# Altium schematic sheet Main.SchDoc
size A4
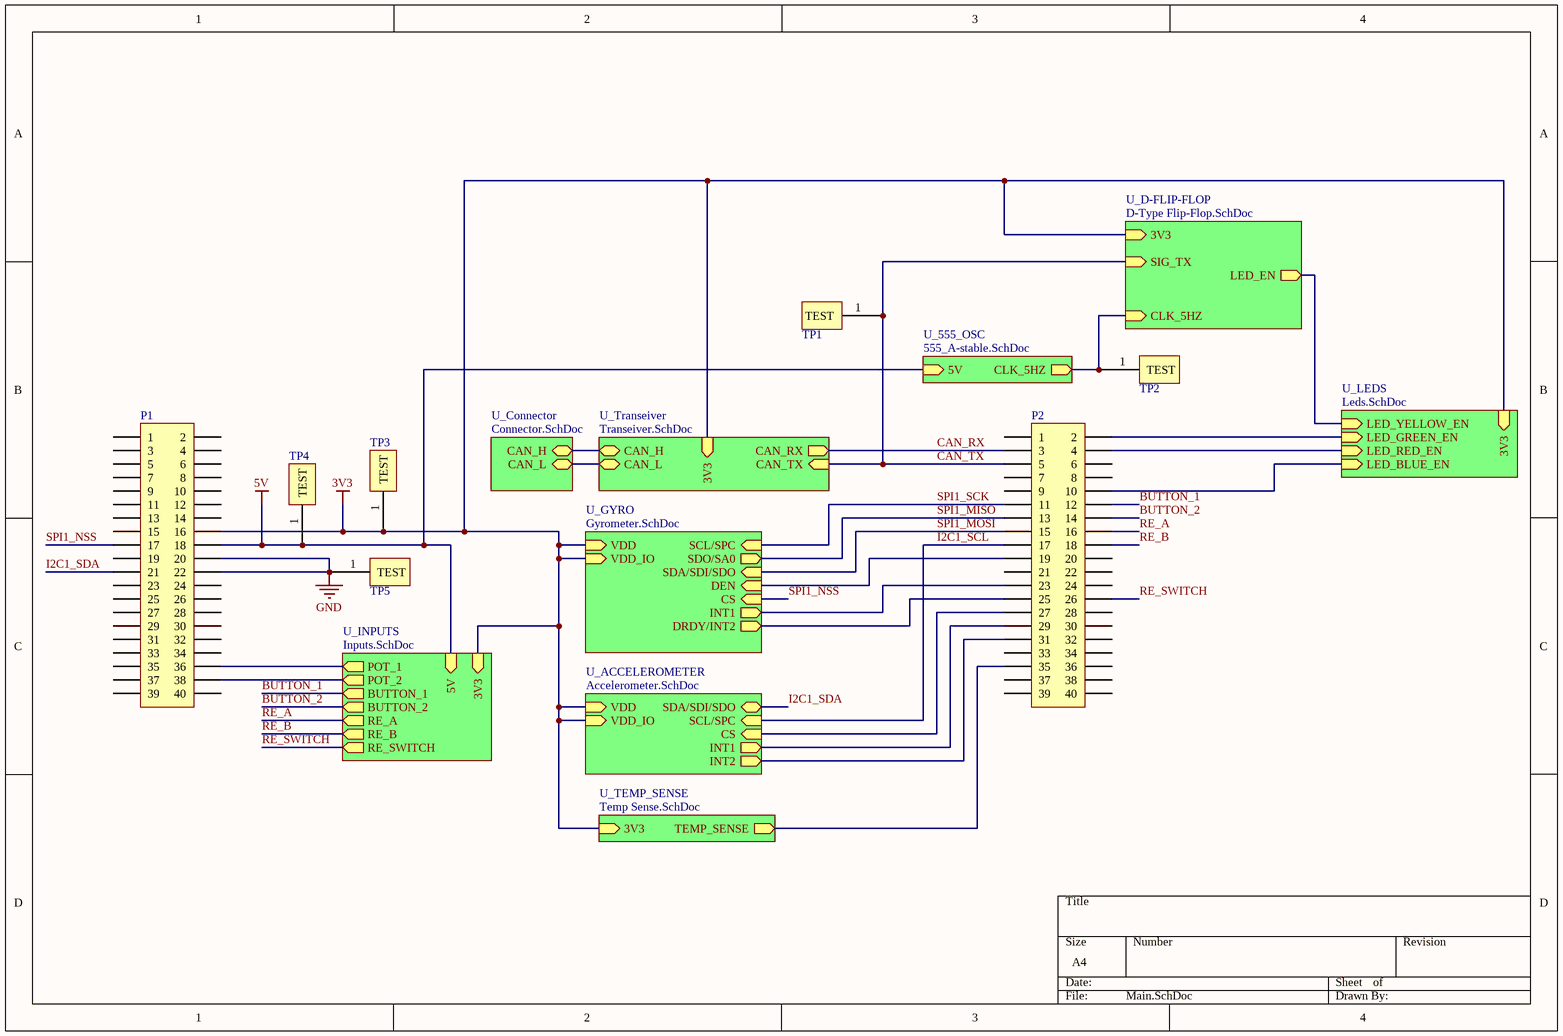
[diagram p0: Main.SchDoc]

## Parts
P1  Female Header 20x2_BOTTOM  [FEMALE HDR2X20_BOTTOM]  (value not drawn)
P2  Female Header 20x2_BOTTOM  [FEMALE HDR2X20_BOTTOM]  (value not drawn)
TP1  Keystone Electronics 5000  [TEST POINT 5000K]  (value not drawn)
TP2  Keystone Electronics 5000  [TEST POINT 5000K]  (value not drawn)
TP3  Keystone Electronics 5000  [TEST POINT 5000K]  (value not drawn)
TP4  Keystone Electronics 5000  [TEST POINT 5000K]  (value not drawn)
TP5  Keystone Electronics 5000  [TEST POINT 5000K]  (value not drawn)

## Sub-sheets
U_555_OSC = 555_A-stable.SchDoc: CLK_5HZ (out), 5V (in)
U_ACCELEROMETER = Accelerometer.SchDoc: SDA/SDI/SDO (bidir), SCL/SPC (in), CS (in), INT1 (out), INT2 (out), VDD (in), VDD_IO (in)
U_Connector = Connector.SchDoc: CAN_H (bidir), CAN_L (bidir)
U_D-FLIP-FLOP = D-Type Flip-Flop.SchDoc: SIG_TX (in), CLK_5HZ (in), LED_EN (out), 3V3 (in)
U_GYRO = Gyrometer.SchDoc: SCL/SPC (in), SDA/SDI/SDO (in), SDO/SA0 (out), CS (in), DEN (in), INT1 (out), DRDY/INT2 (out), VDD (in), VDD_IO (in)
U_INPUTS = Inputs.SchDoc: BUTTON_1 (out), BUTTON_2 (out), POT_1 (out), POT_2 (out), 3V3 (in), 5V (in), RE_A (out), RE_B (out), RE_SWITCH (out)
U_LEDS = Leds.SchDoc: LED_BLUE_EN (in), LED_GREEN_EN (in), LED_RED_EN (in), LED_YELLOW_EN (in), 3V3 (in)
U_TEMP_SENSE = Temp Sense.SchDoc: TEMP_SENSE (out), 3V3 (in)
U_Transeiver = Transeiver.SchDoc: CAN_L (bidir), CAN_H (bidir), CAN_TX (in), CAN_RX (out), 3V3 (in)

## Nets
3V3: P1.16 TP3.1(TEST) ; sheet U_Transeiver/3V3, sheet U_TEMP_SENSE/3V3, sheet U_ACCELEROMETER/VDD, sheet U_ACCELEROMETER/VDD_IO, sheet U_GYRO/VDD, sheet U_GYRO/VDD_IO, sheet U_LEDS/3V3, sheet U_INPUTS/3V3, sheet U_D-FLIP-FLOP/3V3
5V: P1.18 TP4.1(TEST) ; sheet U_INPUTS/5V, sheet U_555_OSC/5V
GND: P1.20 P1.22 TP5.1(TEST)
BUTTON_1: P2.12 ; sheet U_INPUTS/BUTTON_1
BUTTON_2: P2.14 ; sheet U_INPUTS/BUTTON_2
CAN_RX: P2.3 ; sheet U_Transeiver/CAN_RX
CAN_TX: P2.5 TP1.1(TEST) ; sheet U_Transeiver/CAN_TX, sheet U_D-FLIP-FLOP/SIG_TX
I2C1_SCL: P2.17 ; sheet U_ACCELEROMETER/SCL/SPC
I2C1_SDA: P1.21 ; sheet U_ACCELEROMETER/SDA/SDI/SDO
RE_A: P2.16 ; sheet U_INPUTS/RE_A
RE_B: P2.18 ; sheet U_INPUTS/RE_B
RE_SWITCH: P2.26 ; sheet U_INPUTS/RE_SWITCH
SPI1_MISO: P2.13 ; sheet U_GYRO/SDO/SA0
SPI1_MOSI: P2.15 ; sheet U_GYRO/SDA/SDI/SDO
SPI1_NSS: P1.17 ; sheet U_GYRO/CS
SPI1_SCK: P2.11 ; sheet U_GYRO/SCL/SPC
NetP1_36: P1.36 ; sheet U_INPUTS/POT_1
NetP1_38: P1.38 ; sheet U_INPUTS/POT_2
NetP2_2: P2.2 ; sheet U_LEDS/LED_GREEN_EN
NetP2_4: P2.4 ; sheet U_LEDS/LED_RED_EN
NetP2_10: P2.10 ; sheet U_LEDS/LED_BLUE_EN
NetP2_19: P2.19 ; sheet U_GYRO/DEN
NetP2_23: P2.23 ; sheet U_GYRO/INT1
NetP2_25: P2.25 ; sheet U_GYRO/DRDY/INT2
NetP2_27: P2.27 ; sheet U_ACCELEROMETER/CS
NetP2_29: P2.29 ; sheet U_ACCELEROMETER/INT1
NetP2_31: P2.31 ; sheet U_ACCELEROMETER/INT2
NetP2_35: P2.35 ; sheet U_TEMP_SENSE/TEMP_SENSE
NetTP2_1: TP2.1(TEST) ; sheet U_D-FLIP-FLOP/CLK_5HZ, sheet U_555_OSC/CLK_5HZ
(unnamed): sheet U_Transeiver/CAN_L, sheet U_Connector/CAN_L
(unnamed): sheet U_Transeiver/CAN_H, sheet U_Connector/CAN_H
(unnamed): sheet U_LEDS/LED_YELLOW_EN, sheet U_D-FLIP-FLOP/LED_EN

Not connected (* = marked no-connect by the designer): P1 1 2 3 4 5 6 7 8 9 10 11 12 13 14 15 19 23 24 25 26 27 28 29 30 31 32 33 34 35 37 39 40; P2 1 6 7 8 9 20 21 22 24 28 30 32 33 34 36 37 38 39 40

## Library data of the parts
P1 P2 = Female Header 20x2_BOTTOM: CONN HEADR FMALE 20POS .1" DL AU; Supplier 1: Digi-Key; Supplier Part Number 1: S9197-ND
TP1-TP5 = Keystone Electronics 5000: TEST POINT PC MINI .040"D RED; Mounting Type: 0.040" (1.02mm) Hole Diameter; Type: PC Test Point, Miniature; Supplier 1: Digi-Key; Supplier Part Number 1: 36-5000-ND